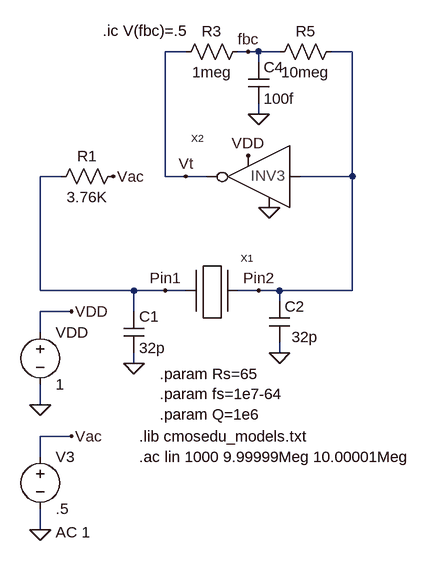
[diagram p0: schematic 10_CrystalModel_10MHz_Network_Inverter3_Qparam3_xtal.asc]
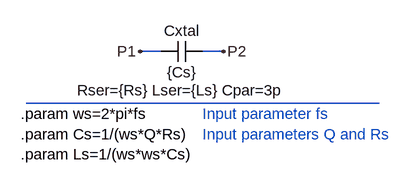
[diagram p1: sub-circuit xtal_param.asc]
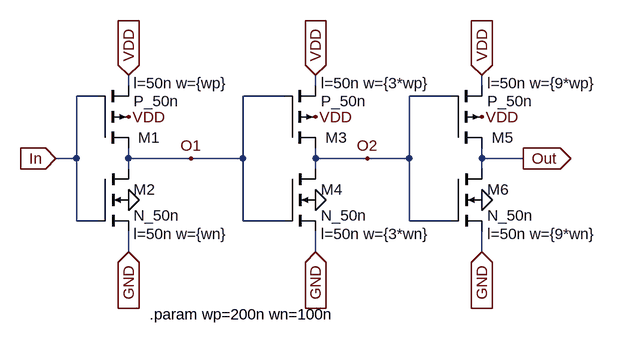
[diagram p2: sub-circuit inv3.asc]
10_CrystalModel_10MHz_Network_Inverter3_Qparam3_xtal.asc, the LTspice schematic file:
Version 4
SHEET 1 1916 1076
WIRE 368 -96 336 -96
WIRE 464 -96 448 -96
WIRE 480 -96 464 -96
WIRE 512 -96 480 -96
WIRE 624 -96 592 -96
WIRE 480 -80 480 -96
WIRE 480 0 480 -16
WIRE 176 96 144 96
WIRE 336 96 336 -96
WIRE 368 96 336 96
WIRE 400 96 368 96
WIRE 624 96 624 -96
WIRE 624 96 544 96
WIRE 144 272 144 96
WIRE 288 272 144 272
WIRE 336 272 288 272
WIRE 368 272 336 272
WIRE 480 272 448 272
WIRE 512 272 480 272
WIRE 624 272 624 96
WIRE 624 272 512 272
WIRE 512 288 512 272
WIRE 192 304 144 304
WIRE 288 304 288 272
WIRE 144 336 144 304
WIRE 512 368 512 352
WIRE 288 384 288 368
WIRE 144 448 144 416
WIRE 192 496 144 496
WIRE 144 528 144 496
WIRE 144 640 144 608
FLAG 512 368 0
FLAG 288 384 0
FLAG 192 304 VDD
FLAG 144 448 0
FLAG 144 640 0
FLAG 192 496 Vac
FLAG 480 0 0
FLAG 464 -96 fbc
FLAG 368 96 Vt
FLAG 336 272 Pin1
FLAG 480 272 Pin2
FLAG 496 144 0
FLAG 464 64 VDD
FLAG 256 96 Vac
SYMBOL res 272 80 R90
WINDOW 0 0 56 VBottom 0
WINDOW 3 32 56 VTop 0
SYMATTR InstName R1
SYMATTR Value 3.76K
SYMBOL cap 272 304 R0
SYMATTR Value 32p
SYMATTR InstName C1
SYMBOL cap 496 288 R0
WINDOW 3 35 55 Left 0
SYMATTR Value 32p
SYMATTR InstName C2
SYMBOL voltage 144 320 R0
WINDOW 123 0 0 Left 0
WINDOW 39 0 0 Left 0
SYMATTR InstName VDD
SYMATTR Value 1
SYMBOL res 352 -80 R270
WINDOW 0 32 56 VTop 0
WINDOW 3 0 56 VBottom 0
SYMATTR InstName R3
SYMATTR Value 1meg
SYMBOL voltage 144 512 R0
WINDOW 123 24 132 Left 0
WINDOW 39 0 0 Left 0
SYMATTR Value2 AC 1
SYMATTR InstName V3
SYMATTR Value .5
SYMBOL res 496 -80 R270
WINDOW 0 32 56 VTop 0
WINDOW 3 0 56 VBottom 0
SYMATTR InstName R5
SYMATTR Value 10meg
SYMBOL cap 464 -80 R0
SYMATTR InstName C4
SYMATTR Value 100f
SYMBOL xtal_param 368 304 R0
SYMATTR InstName X1
SYMBOL inv3 528 144 M0
SYMATTR InstName X2
TEXT 296 528 Left 0 !.ac lin 1000 9.99999Meg 10.00001Meg
TEXT 296 496 Left 0 !.lib cmosedu_models.txt
TEXT 240 -128 Left 0 !.ic V(fbc)=.5
TEXT 328 400 Left 0 !.param Rs=65\n.param fs=1e7-64\n.param Q=1e6

xtal_param.asc, the sub-circuit schematic file:
Version 4
SHEET 1 880 680
WIRE 176 144 144 144
WIRE 272 144 240 144
FLAG 144 144 P1
FLAG 272 144 P2
SYMBOL cap 240 128 R90
WINDOW 0 0 32 VBottom 0
WINDOW 3 32 32 VTop 0
WINDOW 39 60 32 VTop 0
SYMATTR InstName Cxtal
SYMATTR Value {Cs}
SYMATTR SpiceLine Rser={Rs} Lser={Ls} Cpar=3p
TEXT -40 240 Left 0 !.param ws=2*pi*fs\n.param Cs=1/(ws*Q*Rs)\n.param Ls=1/(ws*ws*Cs)
TEXT 240 240 Left 0 ;Input parameter fs\nInput parameters Q and Rs
LINE Normal 512 224 -32 224

inv3.asc, the sub-circuit schematic file:
Version 4
SHEET 1 880 680
WIRE -448 0 -448 -16
WIRE -160 0 -160 -16
WIRE 96 0 96 -16
WIRE -496 16 -528 16
WIRE -208 16 -272 16
WIRE 48 16 -16 16
WIRE -528 112 -528 16
WIRE -528 112 -560 112
WIRE -448 112 -448 96
WIRE -352 112 -448 112
WIRE -272 112 -272 16
WIRE -272 112 -352 112
WIRE -160 112 -160 96
WIRE -80 112 -160 112
WIRE -16 112 -16 16
WIRE -16 112 -80 112
WIRE 96 112 96 96
WIRE 160 112 96 112
WIRE -448 128 -448 112
WIRE -160 128 -160 112
WIRE 96 128 96 112
WIRE -528 208 -528 112
WIRE -496 208 -528 208
WIRE -272 208 -272 112
WIRE -208 208 -272 208
WIRE -16 208 -16 112
WIRE 48 208 -16 208
WIRE -448 256 -448 224
WIRE -160 256 -160 224
WIRE 96 256 96 224
FLAG -448 48 VDD
FLAG -448 176 0
FLAG -448 -16 VDD
IOPIN -448 -16 In
FLAG -160 48 VDD
FLAG -160 176 0
FLAG -160 -16 VDD
IOPIN -160 -16 In
FLAG 96 48 VDD
FLAG 96 176 0
FLAG 96 -16 VDD
IOPIN 96 -16 In
FLAG 160 112 Out
IOPIN 160 112 Out
FLAG -80 112 O2
FLAG -352 112 O1
FLAG -560 112 In
IOPIN -560 112 In
FLAG -448 256 GND
IOPIN -448 256 In
FLAG -160 256 GND
IOPIN -160 256 In
FLAG 96 256 GND
IOPIN 96 256 In
SYMBOL pmos4 -496 96 M180
WINDOW 0 63 16 Left 0
WINDOW 123 56 100 Left 0
SYMATTR InstName M1
SYMATTR Value2 l=50n w={wp}
SYMATTR Value P_50n
SYMBOL nmos4 -496 128 R0
WINDOW 123 56 100 Left 0
SYMATTR Value2 l=50n w={wn}
SYMATTR InstName M2
SYMATTR Value N_50n
SYMBOL pmos4 -208 96 M180
WINDOW 0 63 16 Left 0
WINDOW 123 56 100 Left 0
SYMATTR InstName M3
SYMATTR Value2 l=50n w={3*wp}
SYMATTR Value P_50n
SYMBOL nmos4 -208 128 R0
WINDOW 123 56 100 Left 0
SYMATTR Value2 l=50n w={3*wn}
SYMATTR InstName M4
SYMATTR Value N_50n
SYMBOL pmos4 48 96 M180
WINDOW 0 63 16 Left 0
WINDOW 123 56 100 Left 0
SYMATTR InstName M5
SYMATTR Value2 l=50n w={9*wp}
SYMATTR Value P_50n
SYMBOL nmos4 48 128 R0
WINDOW 123 56 100 Left 0
SYMATTR Value2 l=50n w={9*wn}
SYMATTR InstName M6
SYMATTR Value N_50n
TEXT -416 352 Left 0 !.param wp=200n wn=100n

The netlist it stands for:
* 10_CrystalModel_10MHz_Network_Inverter3_Qparam3_xtal.asc
R1 Vac Pin1 3.76K
C1 Pin1 0 32p
C2 Pin2 0 32p
VDD VDD 0 1
R3 Vt fbc 1meg
V3 Vac 0 .5 AC 1
R5 fbc Pin2 10meg
C4 fbc 0 100f
XX1 Pin1 Pin2 xtal_param
XX2 Pin2 Vt VDD 0 inv3

* block symbol definitions
.subckt xtal_param P1 P2
Cxtal P2 P1 {Cs} Rser={Rs} Lser={Ls} Cpar=3p
.param ws=2*pi*fs
.param Cs=1/(ws*Q*Rs)
.param Ls=1/(ws*ws*Cs)
* Input parameter fs
* Input parameters Q and Rs
.ends xtal_param

.subckt inv3 In Out VDD GND
M1 O1 In VDD VDD P_50n l=50n w={wp}
M2 O1 In GND 0 N_50n l=50n w={wn}
M3 O2 O1 VDD VDD P_50n l=50n w={3*wp}
M4 O2 O1 GND 0 N_50n l=50n w={3*wn}
M5 Out O2 VDD VDD P_50n l=50n w={9*wp}
M6 Out O2 GND 0 N_50n l=50n w={9*wn}
.param wp=200n wn=100n
.ends inv3

.model NMOS NMOS
.model PMOS PMOS
.lib standard.mos
.ac lin 1000 9.99999Meg 10.00001Meg
.lib cmosedu_models.txt
.ic V(fbc)=.5
.param Rs=65
.param fs=1e7-64
.param Q=1e6
.backanno
.end